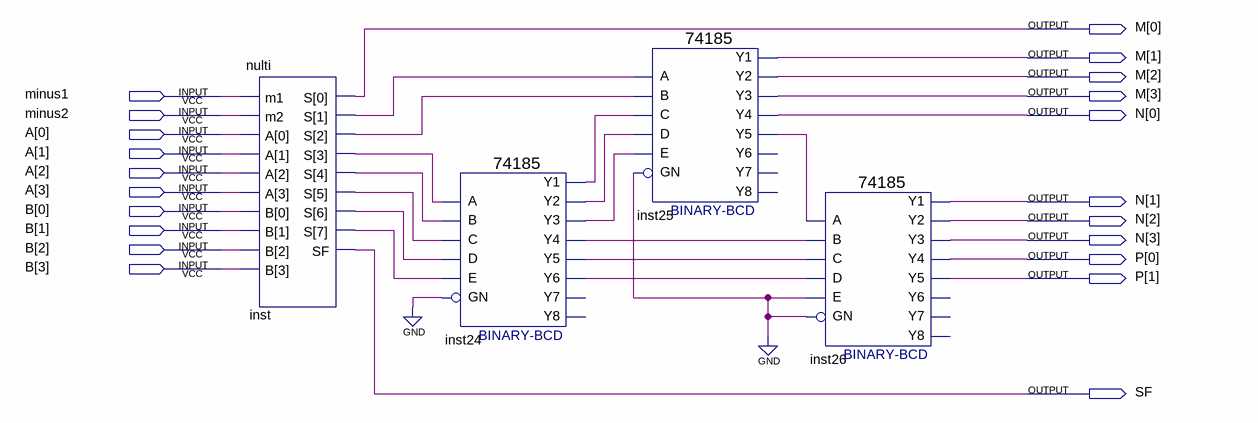
[diagram p0: schematic sheet]
// Quartus schematic multi_BCD.bdf as structural Verilog: 4 symbols, 21 pins
module multi_BCD (
  input  minus1,
  input  minus2,
  input  [3:0] A,
  input  [3:0] B,
  output [3:0] M,
  output [3:0] N,
  output [1:0] P,
  output SF
);

  wire inst24_y1, inst24_y2, inst24_y3, inst24_y4, inst24_y5, inst24_y6, inst25_y5, inst_s, inst_s_2,
       inst_s_3, inst_s_4, inst_s_5, inst_s_6, inst_s_7;

  nulti inst (
    .m1(minus1), .m2(minus2), .A(A), .B(B),
    .S({inst_s_7, inst_s_6, inst_s_5, inst_s_4, inst_s_3, inst_s_2, inst_s, M[0]}), .SF(SF));
  \74185  inst24 (
    .A(inst_s_3), .B(inst_s_4), .D(inst_s_6), .C(inst_s_5), .E(inst_s_7), .GN(1'b0), .Y1(inst24_y1),
    .Y3(inst24_y3), .Y2(inst24_y2), .Y5(inst24_y5), .Y4(inst24_y4), .Y6(inst24_y6));  // open: Y8, Y7
  \74185  inst25 (
    .A(inst_s), .B(inst_s_2), .D(inst24_y2), .C(inst24_y1), .E(inst24_y3), .GN(1'b0), .Y1(M[1]), .Y3(M[3]),
    .Y2(M[2]), .Y5(inst25_y5), .Y4(N[0]));  // open: Y6, Y8, Y7
  \74185  inst26 (
    .A(inst25_y5), .B(inst24_y4), .D(inst24_y6), .C(inst24_y5), .E(1'b0), .GN(1'b0), .Y1(N[1]), .Y3(N[3]),
    .Y2(N[2]), .Y5(P[1]), .Y4(P[0]));  // open: Y6, Y8, Y7
endmodule
